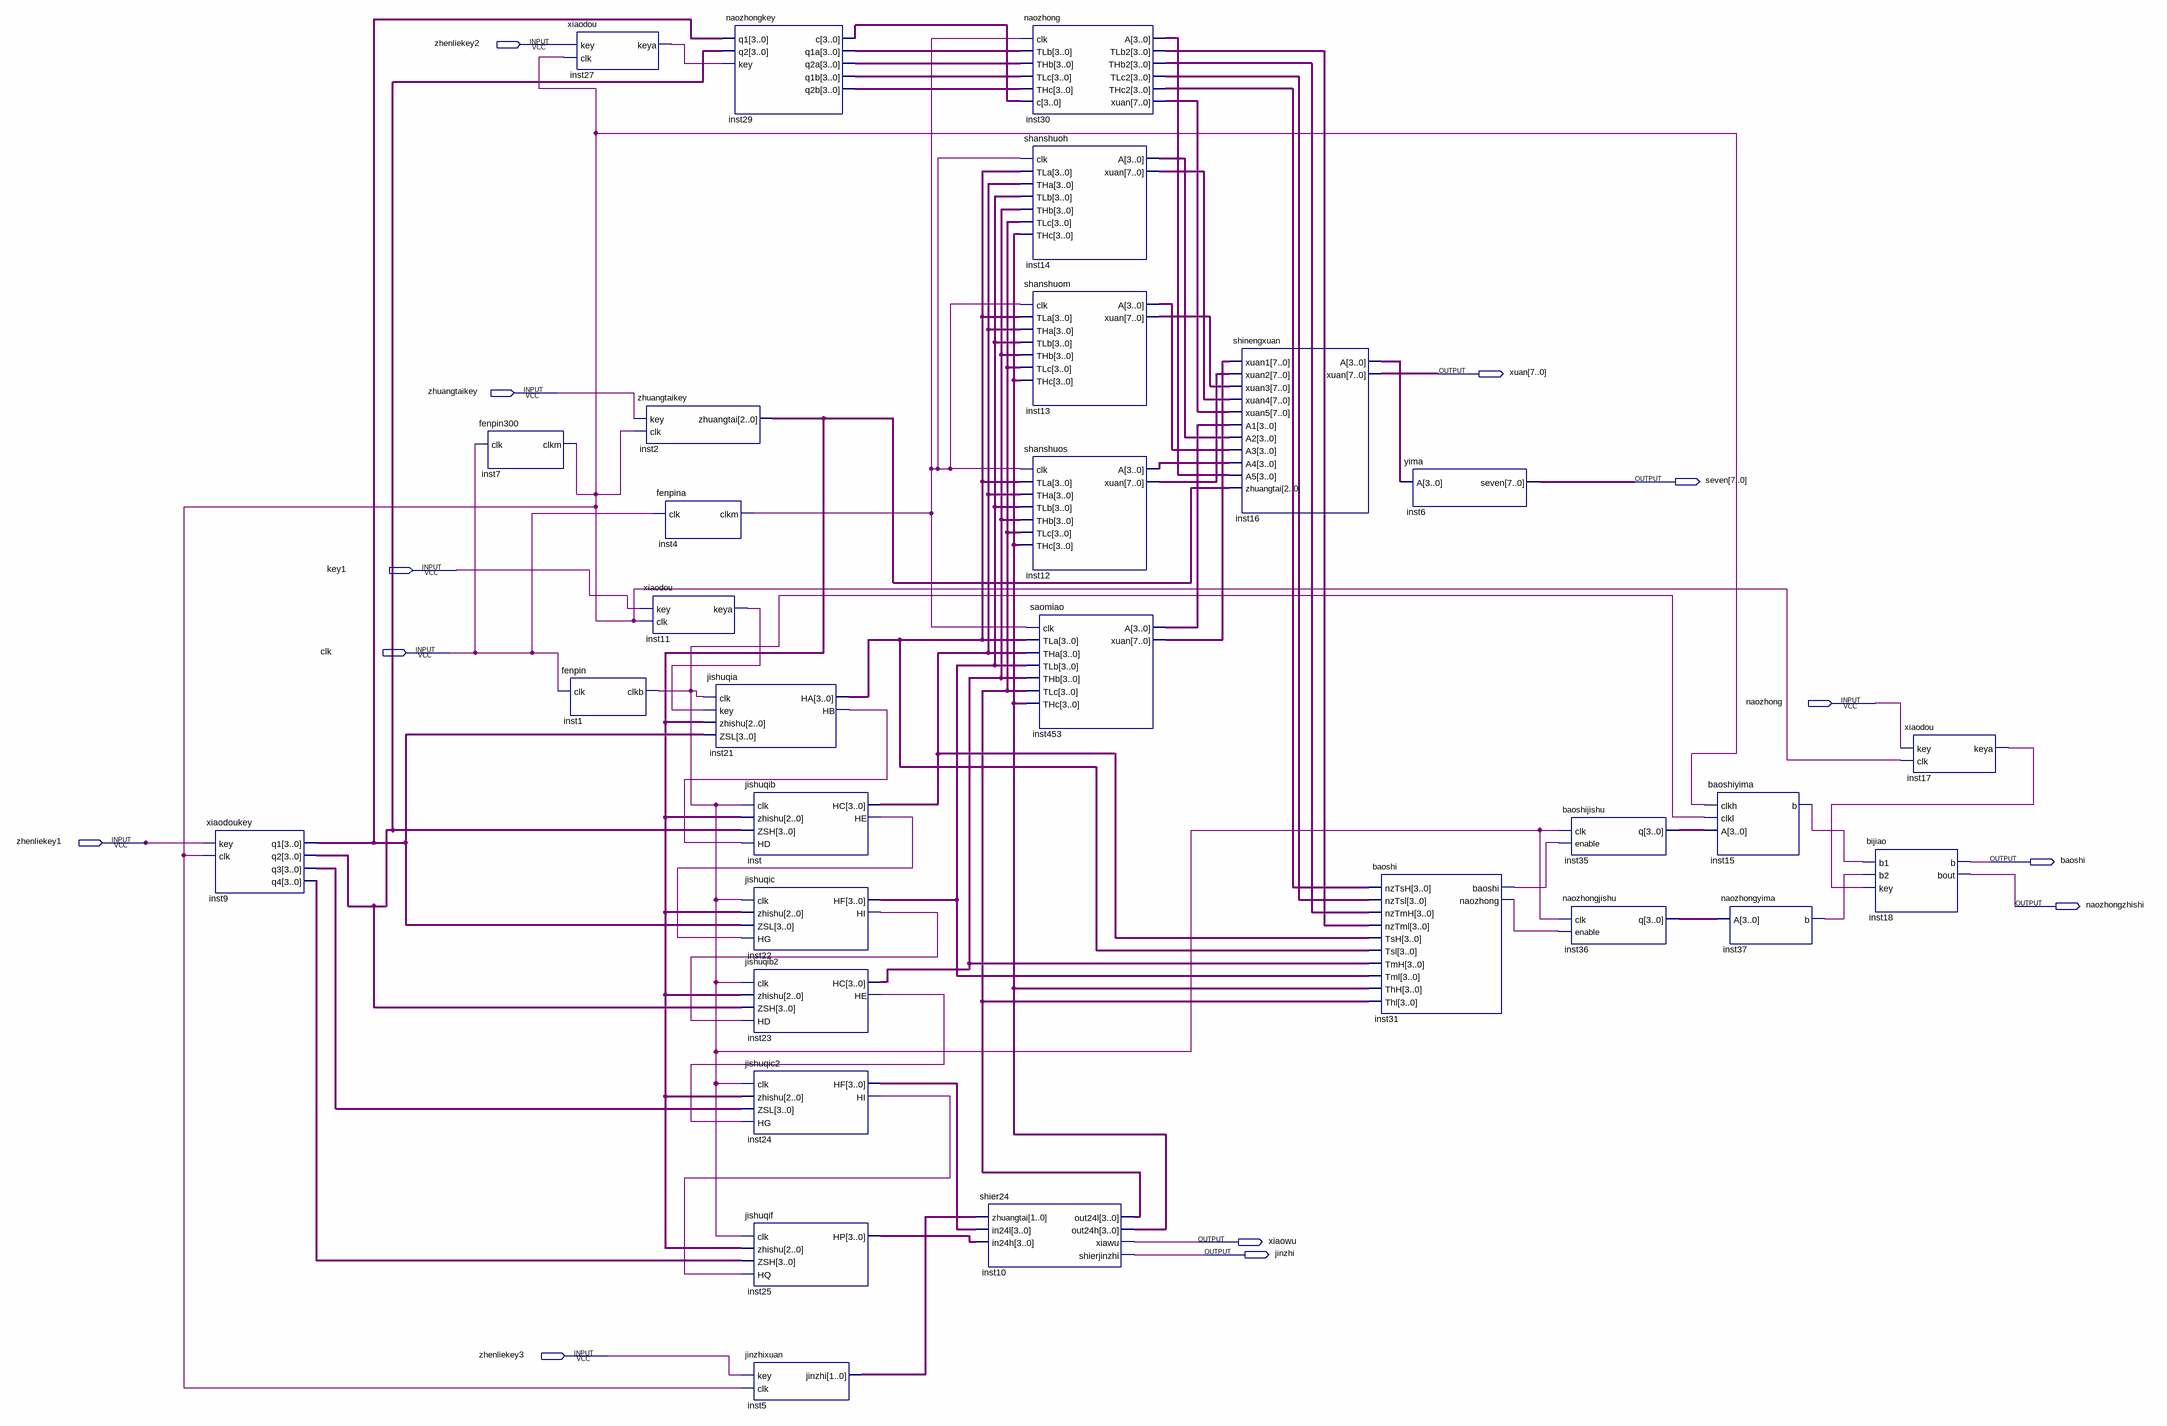
[diagram p0: schematic sheet]
// Quartus schematic yuanlitu.bdf as structural Verilog: 30 symbols, 13 pins
module yuanlitu (
  input  zhenliekey2,
  input  zhuangtaikey,
  input  key1,
  input  clk,
  input  naozhong,
  input  zhenliekey1,
  input  zhenliekey3,
  output [7:0] xuan,
  output [7:0] seven,
  output baoshi,
  output naozhongzhishi,
  output xiaowu,
  output jinzhi
);

  wire inst1_clkb, inst4_clkm, inst7_clkm, inst11_keya, inst15_b, inst17_keya, inst21_hb, inst22_hi,
       inst23_he, inst24_hi, inst27_keya, inst31_baoshi, inst31_naozhong, inst37_b, inst_he;
  wire [1:0] inst5_jinzhi;
  wire [2:0] inst2_zhuangtai;
  wire [3:0] inst9_q1, inst9_q2, inst9_q3, inst9_q4, inst10_out24h, inst10_out24l, inst12_a, inst13_a,
       inst14_a, inst16_a, inst21_ha, inst22_hf, inst23_hc, inst24_hf, inst25_hp, inst29_c, inst29_q1a,
       inst29_q1b, inst29_q2a, inst29_q2b, inst30_a, inst30_thb2, inst30_thc2, inst30_tlb2, inst30_tlc2,
       inst35_q, inst36_q, inst453_a, inst_hc;
  wire [7:0] inst12_xuan, inst13_xuan, inst14_xuan, inst30_xuan, inst453_xuan;

  xiaodoukey inst9 (.key(zhenliekey1), .clk(inst7_clkm), .q1(inst9_q1), .q2(inst9_q2), .q3(inst9_q3), .q4(inst9_q4));
  fenpin300 inst7 (.clk(clk), .clkm(inst7_clkm));
  xiaodou inst27 (.key(zhenliekey2), .clk(inst7_clkm), .keya(inst27_keya));
  fenpin inst1 (.clk(clk), .clkb(inst1_clkb));
  zhuangtaikey inst2 (.key(zhuangtaikey), .clk(inst7_clkm), .zhuangtai(inst2_zhuangtai));
  fenpina inst4 (.clk(clk), .clkm(inst4_clkm));
  xiaodou inst11 (.key(key1), .clk(inst7_clkm), .keya(inst11_keya));
  naozhongkey inst29 (
    .q1(inst9_q1), .q2(inst9_q2), .key(inst27_keya), .c(inst29_c), .q1a(inst29_q1a), .q2a(inst29_q2a),
    .q1b(inst29_q1b), .q2b(inst29_q2b));
  jishuqia inst21 (
    .clk(inst1_clkb), .key(inst11_keya), .zhishu(inst2_zhuangtai), .ZSL(inst9_q1), .HA(inst21_ha),
    .HB(inst21_hb));
  jishuqib inst (
    .clk(inst1_clkb), .zhishu(inst2_zhuangtai), .ZSH(inst9_q2), .HD(inst21_hb), .HC(inst_hc), .HE(inst_he));
  jishuqic inst22 (
    .clk(inst1_clkb), .zhishu(inst2_zhuangtai), .ZSL(inst9_q1), .HG(inst_he), .HF(inst22_hf), .HI(inst22_hi));
  jishuqib2 inst23 (
    .clk(inst1_clkb), .zhishu(inst2_zhuangtai), .ZSH(inst9_q2), .HD(inst22_hi), .HC(inst23_hc), .HE(inst23_he));
  jishuqic2 inst24 (
    .clk(inst1_clkb), .zhishu(inst2_zhuangtai), .ZSL(inst9_q3), .HG(inst23_he), .HF(inst24_hf), .HI(inst24_hi));
  jishuqif inst25 (.clk(inst1_clkb), .zhishu(inst2_zhuangtai), .ZSH(inst9_q4), .HQ(inst24_hi), .HP(inst25_hp));
  jinzhixuan inst5 (.key(zhenliekey3), .clk(inst7_clkm), .jinzhi(inst5_jinzhi));
  shier24 inst10 (
    .zhuangtai(inst5_jinzhi), .in24l(inst24_hf), .in24h(inst25_hp), .out24l(inst10_out24l),
    .out24h(inst10_out24h), .xiawu(xiaowu), .shierjinzhi(jinzhi));
  naozhong inst30 (
    .clk(inst4_clkm), .TLb(inst29_q1a), .THb(inst29_q2a), .TLc(inst29_q1b), .THc(inst29_q2b), .c(inst29_c),
    .A(inst30_a), .TLb2(inst30_tlb2), .THb2(inst30_thb2), .TLc2(inst30_tlc2), .THc2(inst30_thc2),
    .xuan(inst30_xuan));
  shanshuoh inst14 (
    .clk(inst4_clkm), .TLa(inst21_ha), .THa(inst_hc), .TLb(inst22_hf), .THb(inst23_hc), .TLc(inst10_out24l),
    .THc(inst10_out24h), .A(inst14_a), .xuan(inst14_xuan));
  shanshuom inst13 (
    .clk(inst4_clkm), .TLa(inst21_ha), .THa(inst_hc), .TLb(inst22_hf), .THb(inst23_hc), .TLc(inst10_out24l),
    .THc(inst10_out24h), .A(inst13_a), .xuan(inst13_xuan));
  shanshuos inst12 (
    .clk(inst4_clkm), .TLa(inst21_ha), .THa(inst_hc), .TLb(inst22_hf), .THb(inst23_hc), .TLc(inst10_out24l),
    .THc(inst10_out24h), .A(inst12_a), .xuan(inst12_xuan));
  saomiao inst453 (
    .clk(inst4_clkm), .TLa(inst21_ha), .THa(inst_hc), .TLb(inst22_hf), .THb(inst23_hc), .TLc(inst10_out24l),
    .THc(inst10_out24h), .A(inst453_a), .xuan(inst453_xuan));
  shinengxuan inst16 (
    .xuan1(inst453_xuan), .xuan2(inst12_xuan), .xuan3(inst13_xuan), .xuan4(inst14_xuan), .xuan5(inst30_xuan),
    .A1(inst453_a), .A2(inst14_a), .A3(inst13_a), .A4(inst12_a), .A5(inst30_a), .zhuangtai(inst2_zhuangtai),
    .A(inst16_a), .xuan(xuan));
  baoshi inst31 (
    .nzTsH(inst30_thc2), .nzTsl(inst30_tlc2), .nzTmH(inst30_thb2), .nzTml(inst30_tlb2), .TsH(inst_hc),
    .Tsl(inst21_ha), .TmH(inst23_hc), .Tml(inst22_hf), .ThH(inst10_out24h), .Thl(inst10_out24l),
    .baoshi(inst31_baoshi), .naozhong(inst31_naozhong));
  yima inst6 (.A(inst16_a), .seven(seven));
  baoshijishu inst35 (.clk(inst1_clkb), .enable(inst31_baoshi), .q(inst35_q));
  naozhongjishu inst36 (.clk(inst1_clkb), .enable(inst31_naozhong), .q(inst36_q));
  baoshiyima inst15 (.clkh(inst7_clkm), .clkl(inst1_clkb), .A(inst35_q), .b(inst15_b));
  naozhongyima inst37 (.A(inst36_q), .b(inst37_b));
  bijiao inst18 (.b1(inst15_b), .b2(inst37_b), .key(inst17_keya), .b(baoshi), .bout(naozhongzhishi));
  xiaodou inst17 (.key(naozhong), .clk(inst7_clkm), .keya(inst17_keya));
endmodule
